# EAGLE design Simple-Fet -v015-pro-mini (EAGLE 7.6.0)
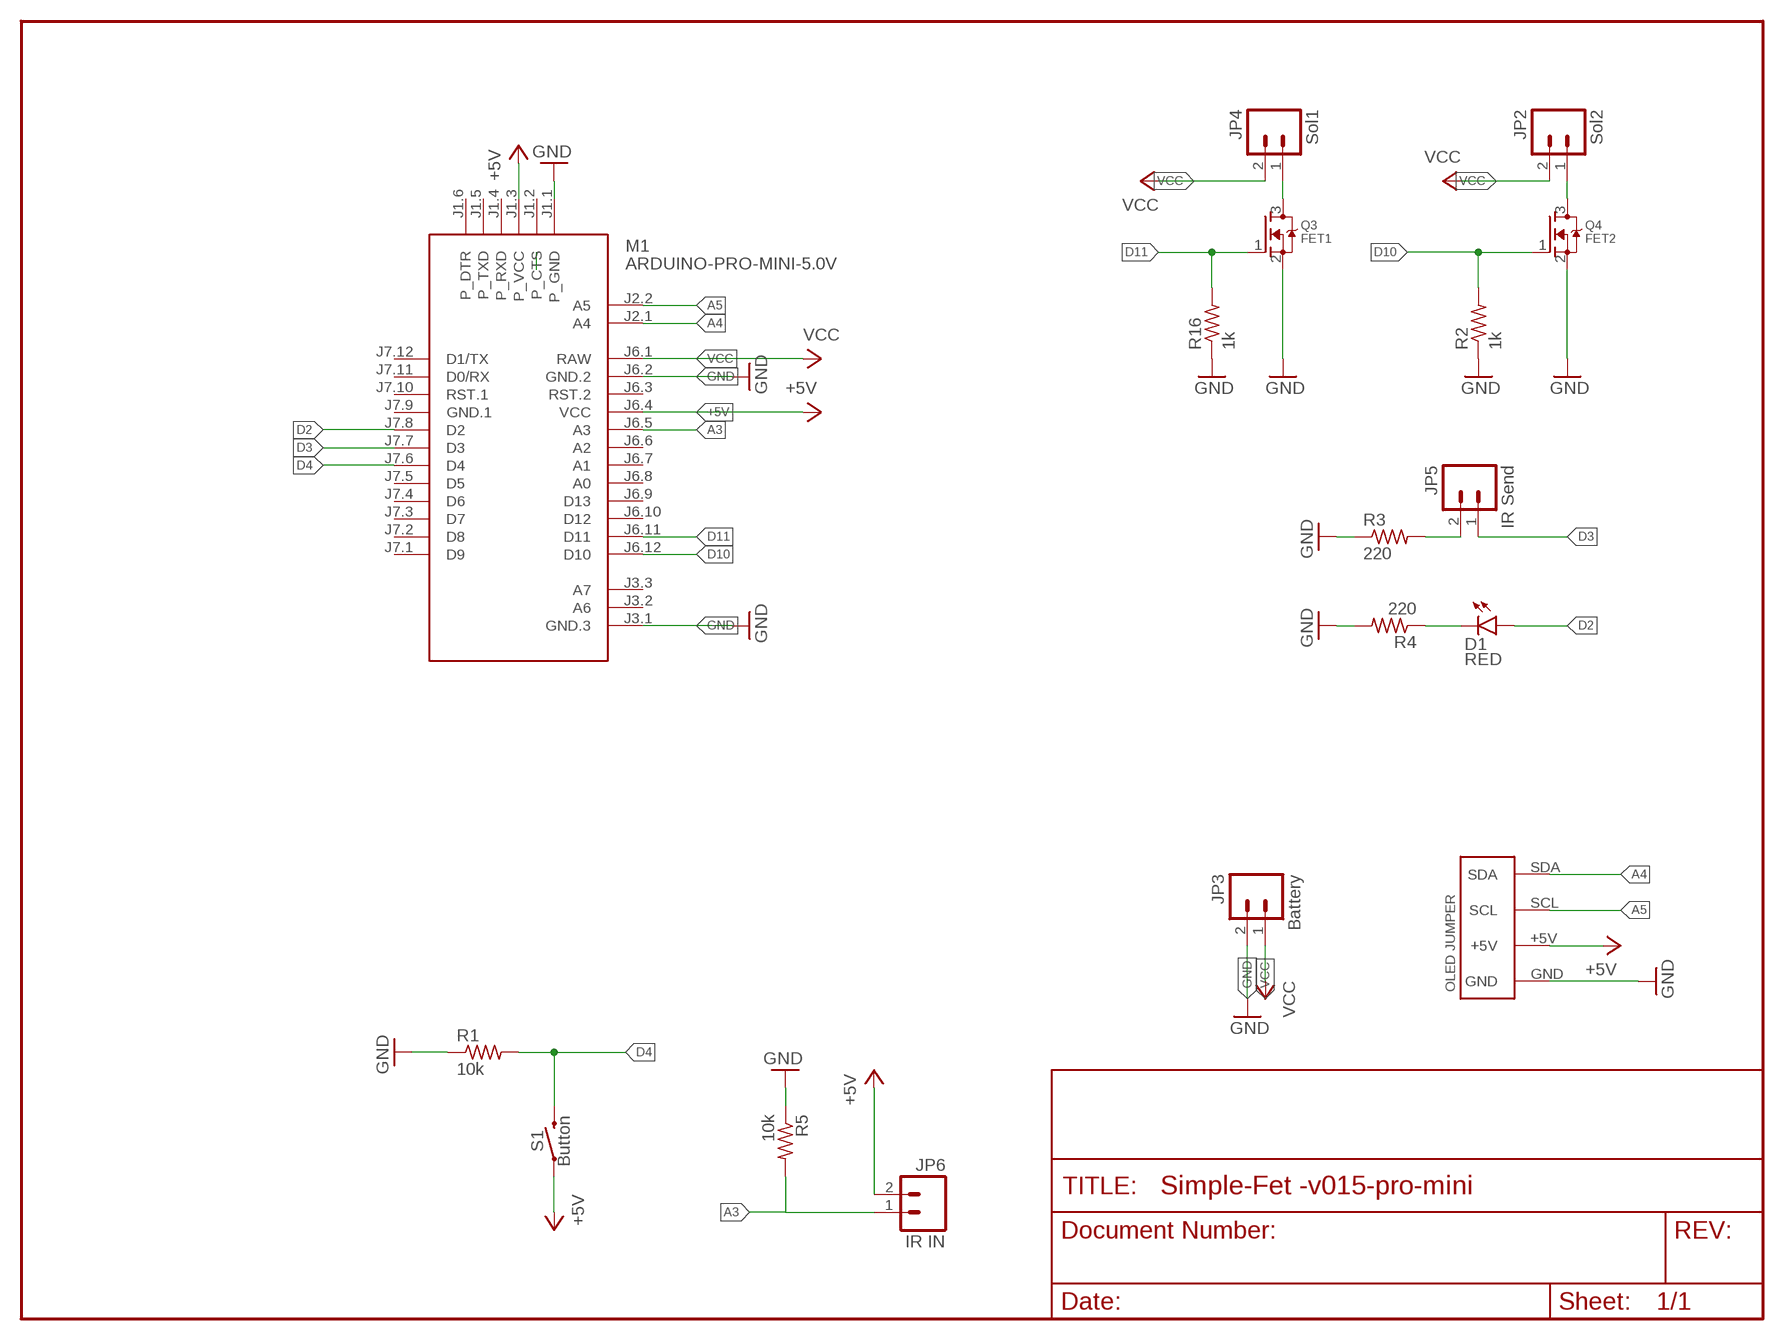
[diagram p0: schematic, sheet 1]

## Parts
D1  RED  LED-RED1206  [LED-1206]
JP2  Sol2  M02PTH  [1X02]
JP3  Battery  M02PTH  [1X02]
JP4  Sol1  M02PTH  [1X02]
JP5  IR Send  M02PTH  [1X02]
JP6  IR IN  M02PTH  [1X02]
M1  ARDUINO-PRO-MINI-5.0V  [ARDUINO-PRO-MINI]
Q3  FET1  MOSFET-NREFLOW  [SOT23]
Q4  FET2  MOSFET-NREFLOW  [SOT23]
R1  10k  R-US_M1206  [M1206]
R2  1k  R-US_M1206  [M1206]
R3  220  R-US_M1206  [M1206]
R4  220  R-US_M1206  [M1206]
R5  10k  R-US_M1206  [M1206]
R16  1k  R-US_M1206  [M1206]
S1  Button  MOMENTARY-SWITCH-SPST-SMD-6.0X3.5MM  [TACTILE_SWITCH_SMD_6.0X3.5MM]
U$2  OLEDHEADER  [OLED-CON]

## Nets
+5V [+5V]: JP6.2 M1.J1.3(P_VCC) M1.J6.4(VCC) S1.1 U$2.+5V
A3: JP6.1 M1.J6.5(A3) R5.2
A4: M1.J2.1(A4) U$2.SDA
A5: M1.J2.2(A5) U$2.SCL
D2: D1.A M1.J7.8(D2)
D3: JP5.1 M1.J7.7(D3)
D4: M1.J7.6(D4) R1.2 S1.2
D10: M1.J6.12(D10) Q4.1(G) R2.2
D11: M1.J6.11(D11) Q3.1(G) R16.2
GND: JP3.2 M1.J1.1(P_GND) M1.J3.1(GND.3) M1.J6.2(GND.2) Q3.2(S) Q4.2(S) R1.1 R2.1 R3.1 R4.2 R5.1 R16.1 U$2.GND
M1 [M2]: JP4.1 Q3.3(D)
M2 [M1]: JP2.1 Q4.3(D)
N$5: D1.C R4.1
N$10: JP5.2 R3.2
VCC [VCC]: JP2.2 JP3.1 JP4.2 M1.J6.1(RAW)
Unconnected: M1.J1.2(P_CTS) M1.J1.4(P_RXD) M1.J1.5(P_TXD) M1.J1.6(P_DTR) M1.J3.2(A6) M1.J3.3(A7) M1.J6.3(RST.2) M1.J6.6(A2) M1.J6.7(A1) M1.J6.8(A0) M1.J6.9(D13) M1.J6.10(D12) M1.J7.1(D9) M1.J7.2(D8) M1.J7.3(D7) M1.J7.4(D6) M1.J7.5(D5) M1.J7.10(RST.1) M1.J7.11(D0/RX) M1.J7.12(D1/TX)

## Power pins joined to a net without a drawn wire
GND.1: M1.J7.9(GND.1)

## Library data of the parts
D1 = SparkFun-LED:LED-RED: Assorted Red LEDs LilyPad 1206- DIO-09912 1206- DIO-00809 0603- DIO-00819 "SMART" means more efficient and expensive; MPN: HSMC-C150; OC_NEWARK: 05M0343; PROD_ID: DIO-09912
JP2 JP4 = SparkFun:M02: Header 2 Standard 2-pin 0.1" header. Use with straight break away headers (SKU : PRT-00116), right angle break away headers (PRT-00553), swiss pins (PRT-00743), machine pins (PRT-00117), and female headers (PRT-00115). Molex polarized connector foot print use with SKU : PRT-08233 with associated crimp pins and housings.; MF: MOLEX; MPN: 22-23-2021; OC_NEWARK: 25C3832
JP3 = SparkFun:M02: Header 2 Standard 2-pin 0.1" header. Use with straight break away headers (SKU : PRT-00116), right angle break away headers (PRT-00553), swiss pins (PRT-00743), machine pins (PRT-00117), and female headers (PRT-00115). Molex polarized connector foot print use with SKU : PRT-08233 with associated crimp pins and housings.; MF: KEYSTONE ELECTR; MPN: 2239; OC_NEWARK: 59K0357
JP5 = SparkFun:M02: Header 2 Standard 2-pin 0.1" header. Use with straight break away headers (SKU : PRT-00116), right angle break away headers (PRT-00553), swiss pins (PRT-00743), machine pins (PRT-00117), and female headers (PRT-00115). Molex polarized connector foot print use with SKU : PRT-08233 with associated crimp pins and housings.; MF: FAIRCHILD SEMICONDUCTOR; MPN: QEE122; OC_NEWARK: 83C0473
JP6 = SparkFun:M02: Header 2 Standard 2-pin 0.1" header. Use with straight break away headers (SKU : PRT-00116), right angle break away headers (PRT-00553), swiss pins (PRT-00743), machine pins (PRT-00117), and female headers (PRT-00115). Molex polarized connector foot print use with SKU : PRT-08233 with associated crimp pins and housings.; MF: FAIRCHILD SEMICONDUCTOR; MPN: QEE113; OC_NEWARK: 78K6116
M1 = diy-modules:ARDUINO-PRO-MINI-*: Arduino Pro Mini and compatible devices More details available here: https://www.arduino.cc/en/Main/ArduinoBoardProMini Click here to find device on ebay.com <http://www.ebay.com/sch/arduino+pro+mini>
Q3 Q4 = adafruit:MOSFET-N: N-Channel Mosfet 2N7002E - 60V 260mA SOT23 [Digikey: 2N7002ET1GOSTR-ND] - REEL BSH103 - 30V 850mA SOT23 [Digikey: 568-5013-1-ND]; MPN: SI2392ADS-T1-GE3; OC_NEWARK: 01AC4985
R1 R5 = resistor:R-US_: RESISTOR, American symbol; MPN: MC1206S4F1002T5E; OC_NEWARK: 79M6135
R2 R16 = resistor:R-US_: RESISTOR, American symbol; MPN: RT1206FRE071KL; OC_NEWARK: 66R9771
R3 R4 = resistor:R-US_: RESISTOR, American symbol; MF: BOURNS, INC.; MPN: CR1206FX2200ELF; OC_NEWARK: 01J3162
S1 = SparkFun-Switches:MOMENTARY-SWITCH-SPST: Momentary Switch (Pushbutton) - SPST Normally-open (NO) SPST momentary switches (buttons, pushbuttons). Variants PTH-12MM - 12mm square, through-hole Momentary Pushbutton Switch - 12mm Square <https://www.sparkfun.com/products/9190> (COM-09190) PTH-6.0MM, PTH-6.0MM-KIT - 6.0mm square, through-hole Mini Pushbutton Switch <https://www.sparkfun.com/products/97> (COM-00097) KIT package intended for soldering kit's - only one side of pads' copper is exposed. PTH-RIGHT-ANGLE-KIT - Right-angle, through-hole Right Angle Tactile Button <https://www.sparkfun.com/products/10791> - Used on SparkFun BigTime Watch Kit <https://www.sparkfun.com/products/11734> SMD-12MM - 12mm square, surface-mount Tactile Button - SMD (12mm) <https://www.sparkfun.com/products/12993> (COM-12993) Used on SparkFun PicoBoard <https://www.sparkfun.com/products/11888> SMD-4.5MM - 4.5mm Square Trackball Switch Used on SparkFun Blackberry Trackballer Breakout <https://www.sparkfun.com/products/13169> SMD-4.6MMX2.8MM - 4.60mm x 2.80mm, surface mount Used on SparkFun SAMD21 Mini Breakout <https://www.sparkfun.com/products/13664> SMD-5.2MM, SMD-5.2-REDUNDANT - 5.2mm square, surface-mount Mini Pushbutton Switch - SMD <https://www.sparkfun.com/products/8720> (COM-08720) Used on Arduino Pro Mini <https://www.sparkfun.com/products/11114> REDUNDANT package connects both switch circuits together SMD-6.0X3.5MM - 6.0 x 3.5mm, surface mount Momentary Reset Switch SMD <https://www.sparkfun.com/products/8229> (COM-08229) SMD-6.2MM-TALL - 6.2mm square, surface mount Tactile Button - SMD (6mm) <https://www.sparkfun.com/products/12992> Used on SparkFun Digital Sandbox <https://www.sparkfun.com/products/12651> SMD-RIGHT-ANGLE - Right-angle, surface mount Used on SparkFun Block for Intel® Edison - Arduino <https://www.sparkfun.com/products/13036>; OC_NEWARK: unknown; PROD_ID: SWCH-00815; SF_SKU: COM-08229
U$2 = solenoid:OLEDHEADER

## Net classes
0 default: width 0.381 mm
1 VCC: width 0.508 mm
2 +5V: width 0.508 mm
3 N$2: width 0.381 mm
4 N$3: width 0.381 mm
5 GND: width 0.381 mm
6 M1: width 0.381 mm
7 M2: width 0.381 mm

## Board
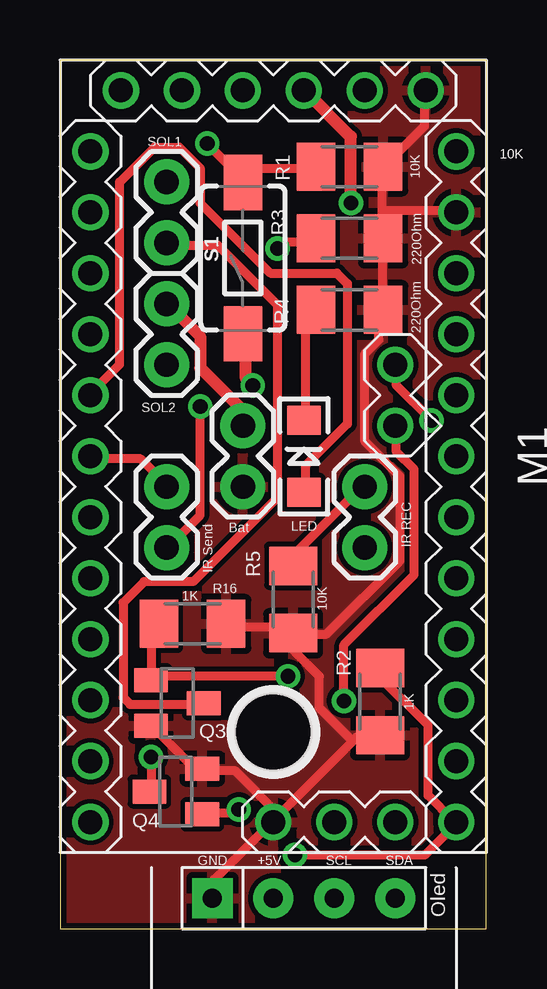
[diagram p1: board, top side]
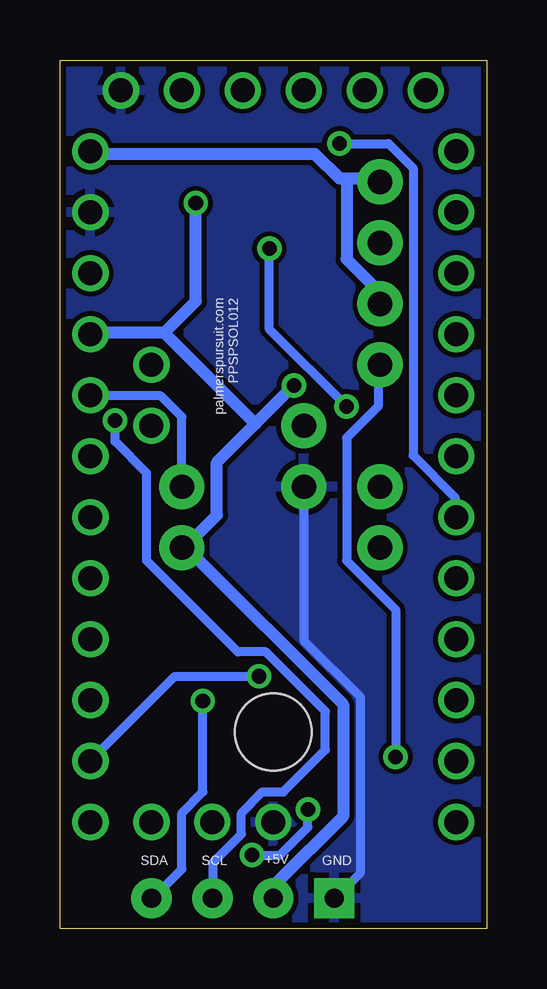
[diagram p2: board, bottom side, seen from below]

Size 17.78 x 36.2 mm. Coordinates in mm from the lower left corner, seen from the top.
Outline: 0,0 17.76,0 17.78,36.2 0,36.2 0,0
Copper layers (1*16): Top 0.035mm / dielectric 1.5mm / Bottom 0.035mm
Design rules "default *": minimum track width 12mil, minimum drill 24mil, track to track 8mil, track to pad 8mil, pad to pad 8mil, via to via 8mil, smd to smd 8mil, copper to edge 10mil, drill to drill 15mil, minimum pad ring 10mil, minimum via ring 8mil, stop-mask expansion 4mil, vias tented up to drill 999mil, thermal gap 10mil
Holes 3.2 mm at 8.89,8.19

### Footprints (pad centres in the part's own frame; a part is rotated, then mirrored left to right if it is on the bottom)
LED-1206 = smd 1.2 x 1.4: A -1.5,0; C 1.5,0
1X02 = drill 1.016 pad 1.88: 1 0,0; 2 2.54,0
ARDUINO-PRO-MINI = drill 1: J1.1 -15.24,6.35; J1.2 -15.24,3.81; J1.3 -15.24,1.27; J1.4 -15.24,-1.27; J1.5 -15.24,-3.81; J1.6 -15.24,-6.35; J2.1 -1.27,5.08; J2.2 -3.81,5.08; J3.1 15.24,0; J3.2 15.24,2.54; J3.3 15.24,5.08; J6.1 -12.7,7.62; J6.2 -10.16,7.62; J6.3 -7.62,7.62; J6.4 -5.08,7.62; J6.5 -2.54,7.62; J6.6 0,7.62; J6.7 2.54,7.62; J6.8 5.08,7.62; J6.9 7.62,7.62; J6.10 10.16,7.62; J6.11 12.7,7.62; J6.12 15.24,7.62; J7.1 15.24,-7.62; J7.2 12.7,-7.62; J7.3 10.16,-7.62; J7.4 7.62,-7.62; J7.5 5.08,-7.62; J7.6 2.54,-7.62; J7.7 0,-7.62; J7.8 -2.54,-7.62; J7.9 -5.08,-7.62; J7.10 -7.62,-7.62; J7.11 -10.16,-7.62; J7.12 -12.7,-7.62
SOT23 = smd 1 x 1.4: 1 -0.95,-1.1; 2 0.95,-1.1; 3 0,1.1
M1206 = smd 1.6 x 2: 1 -1.4,0; 2 1.4,0
TACTILE_SWITCH_SMD_6.0X3.5MM = smd 2.3 x 1.6: 1 -3.15,0; 2 3.15,0
OLED-CON = drill 0.8 pad 1.676: +5V 0,2.54; SCL 0,5.08; SDA 0,7.62 | drill 0.8 pad 1.676 square: GND 0,0

### Placement (x,y rotation side)
D1  10.16,19.68 90 top
JP2  4.45,23.5 90 top
JP3  7.62,20.95 270 top
JP4  4.45,28.57 90 top
JP5  4.45,18.41 270 top
JP6  12.7,18.41 270 top
M1  8.89,19.68 270 top
Q3  4.89,9.4 270 top
Q4  4.83,5.71 90 top
R1  12.06,31.75 180 top
R2  13.34,9.46 90 top
R3  12.06,28.77 180 top
R4  12.06,25.78 0 top
R5  9.72,13.72 90 top
R16  5.52,12.7 180 top
S1  7.62,27.94 90 top
U$2  6.35,1.27 270 top

### Tracks (layer width: path | path; a pad name or v marks a point on that pad's centre or on a via)
+5V  (via drill 0.61)
  Top 0.508: v8.03,22.64 7.74,22.93 7.74,24.68 S1.1 | v12.12,30.23 12.12,33.01 10.22,34.91 M1.J1.3
  Bottom 0.508: 9.64,21.03 11.25,19.43 11.25,17.23 12.56,15.92 JP6.2 12.41,15.77 5.99,9.35 5.99,4.67 8.76,1.9 8.76,1.31 U$2.+5V | 9.64,21.03 v8.03,22.64 | 13.44,24.83 16.5,24.83 M1.J6.4 | 9.64,21.03 13.44,24.83 | v12.12,30.23 12.12,26.14 13.44,24.83
A3
  Top 0.381: R5.2 9.79,15.19 9.79,15.63 12.56,18.4 JP6.1
  Bottom 0.381: M1.J6.5 16.5,22.2 13.58,22.2 12.71,21.32 12.71,18.55 JP6.1
A4  (via drill 0.61)
  Top 0.381: v11.83,9.49 11.83,11.83 14.75,14.75 14.75,19.13 14.02,19.86 14.02,20.89 M1.J2.1
  Bottom 0.381: v11.83,9.49 11.83,5.7 12.71,4.82 12.71,2.48 13.88,1.31 U$2.SDA
A5  (via drill 0.61)
  Top 0.381: v15.48,21.18 14.02,22.64 14.02,23.37 M1.J2.2
  Bottom 0.381: v15.48,21.18 15.48,20.3 14.17,18.99 14.17,15.34 10.37,11.54 9.2,11.54 6.72,9.05 6.72,7.45 8.47,5.7 9.35,5.7 10.22,4.82 10.22,3.94 11.39,2.77 11.39,1.31 U$2.SCL
D2
  Top 0.381: D1.A 10.22,18.26 10.22,19.28 11.98,21.03 11.98,26.87 11.54,27.31 8.76,27.31 5.84,30.23 5.84,31.69 4.97,32.57 3.94,32.57 2.48,31.11 2.48,23.51 1.31,22.35 M1.J7.8
D3
  Top 0.381: M1.J7.7 1.31,19.57 3.36,19.57 4.38,18.55 JP5.1
D4  (via drill 0.61)
  Top 0.381: R1.2 10.66,31.69 8.32,31.69 7.74,31.11 S1.2 7.59,31.25 v6.13,32.72
  Bottom 0.381: v6.13,32.72 4.09,32.72 3.07,31.69 3.07,19.72 1.31,17.96 1.31,17.23 M1.J7.6
D10  (via drill 0.61)
  Top 0.381: v7.45,4.97 7.3,4.82 5.99,4.82 Q4.1 | v9.79,3.07 15.19,3.07 16.5,4.38 M1.J6.12 16.36,4.53 15.34,5.55 15.34,8.47 13.44,10.37 13.44,10.81 R2.2
  Bottom 0.381: v7.45,4.97 7.45,4.24 8.62,3.07 v9.79,3.07
D11  (via drill 0.61)
  Top 0.381: R16.2 4.09,12.56 3.8,12.27 3.8,10.37 Q3.1 3.94,10.52 v9.49,10.52
  Bottom 0.381: v9.49,10.52 13,10.52 16.5,7.01 M1.J6.11
GND
  Top 0.381: 13.44,29.94 13.44,28.92 R3.1 13.44,28.63 13.44,25.85 R4.2 13.29,25.7 13.29,24.54 12.71,23.95 12.71,20.3 14.17,18.84 14.17,15.34 11.1,12.27 9.93,12.27 R5.1 | 13.44,29.94 13.44,31.69 R1.1 13.58,31.84 15.19,33.45 15.19,34.91 M1.J1.1 | 13.44,29.94 16.5,29.94 M1.J6.2 | R16.1 7.01,12.56 9.49,12.56 9.64,12.41 R5.1 | Q3.2 3.8,8.47 5.55,6.72 5.84,6.72 Q4.2 5.99,6.57 7.3,6.57 9.05,4.82 M1.J3.1 | 12.2,7.81 8.91,4.53 M1.J3.1 | 12.2,7.81 12.41,8.03 13.29,8.03 R2.1 | 12.2,7.81 10.81,9.2 10.81,10.52 9.79,11.54 9.79,12.27 R5.1 | U$2.GND 6.43,1.31 6.43,2.04 8.76,4.38 M1.J3.1
  Bottom 0.381: JP3.2 7.59,18.4 7.59,11.98 5.26,9.64 5.26,2.34 6.28,1.31 U$2.GND
  pour Top: 0,36.2 17.78,36.2 17.78,0 0,0
  pour Bottom: 0,36.2 17.78,36.2 17.78,0 0,0
M1
  Top 0.381: Q3.3 5.99,9.35 2.92,9.35 2.63,9.64 2.63,13.58 3.5,14.46 5.55,14.46 9.05,17.96 9.05,26 6.57,28.48 4.53,28.48 JP4.1
M2  (via drill 0.61)
  Top 0.381: v3.8,7.16 3.8,5.84 Q4.3
  Bottom 0.381: v3.8,7.16 3.8,13.29 5.84,15.34 5.84,20.45 4.53,21.76 4.53,23.37 JP2.1
N$5
  Top 0.381: D1.C 10.22,21.32 10.22,25.27 10.66,25.7 R4.1
N$10  (via drill 0.61)
  Top 0.381: v9.05,28.33 9.35,28.63 10.66,28.63 R3.2 | v5.84,21.76 5.84,17.23 4.53,15.92 JP5.2
  Bottom 0.381: v9.05,28.33 9.05,24.98 v5.84,21.76
VCC
  Top 0.508: JP3.1 7.59,21.03 7.59,21.61 5.84,23.37 5.84,24.68 4.53,26 JP2.2
  Bottom 0.508: 5.84,31.25 4.53,31.25 JP4.2 | 5.84,31.25 6.13,31.25 7.16,32.28 16.5,32.28 M1.J6.1 | 5.84,31.25 5.84,27.9 4.53,26.58 4.53,26.14 JP2.2

### Text on the board
tPlace: SOL1 | 10K | 10K | 220Ohm | 220Ohm | SOL2 | IR REC | Bat | LED | IR Send | 1K | 10K | 1K | GND | +5V | SCL | SDA
bPlace: palmerspursuit.com / PPSPSOL012 | GND | +5V | SCL | SDA